# Altium schematic sheet 08 VCC-Connetor.SchDoc: CM4 IO
size 420 x 297 mm; Page Create Date: March  8, 1995; Page Number: 8; Page Size: A3; Comment: radxa_1010; Page Count: 19; RevCode: V1.10; Doc: 08 VCC-Connetor; DsnPath: D:\WMS\黄工\[RC126]CM4_IO_V1.10\[RC126]_V1.10\CM4 IO_V1.10.DSN; SchematicName: CM4 IO V1.10; PageName: 08 VCC-Connetor; PageSize: A3; TopSchematic: True
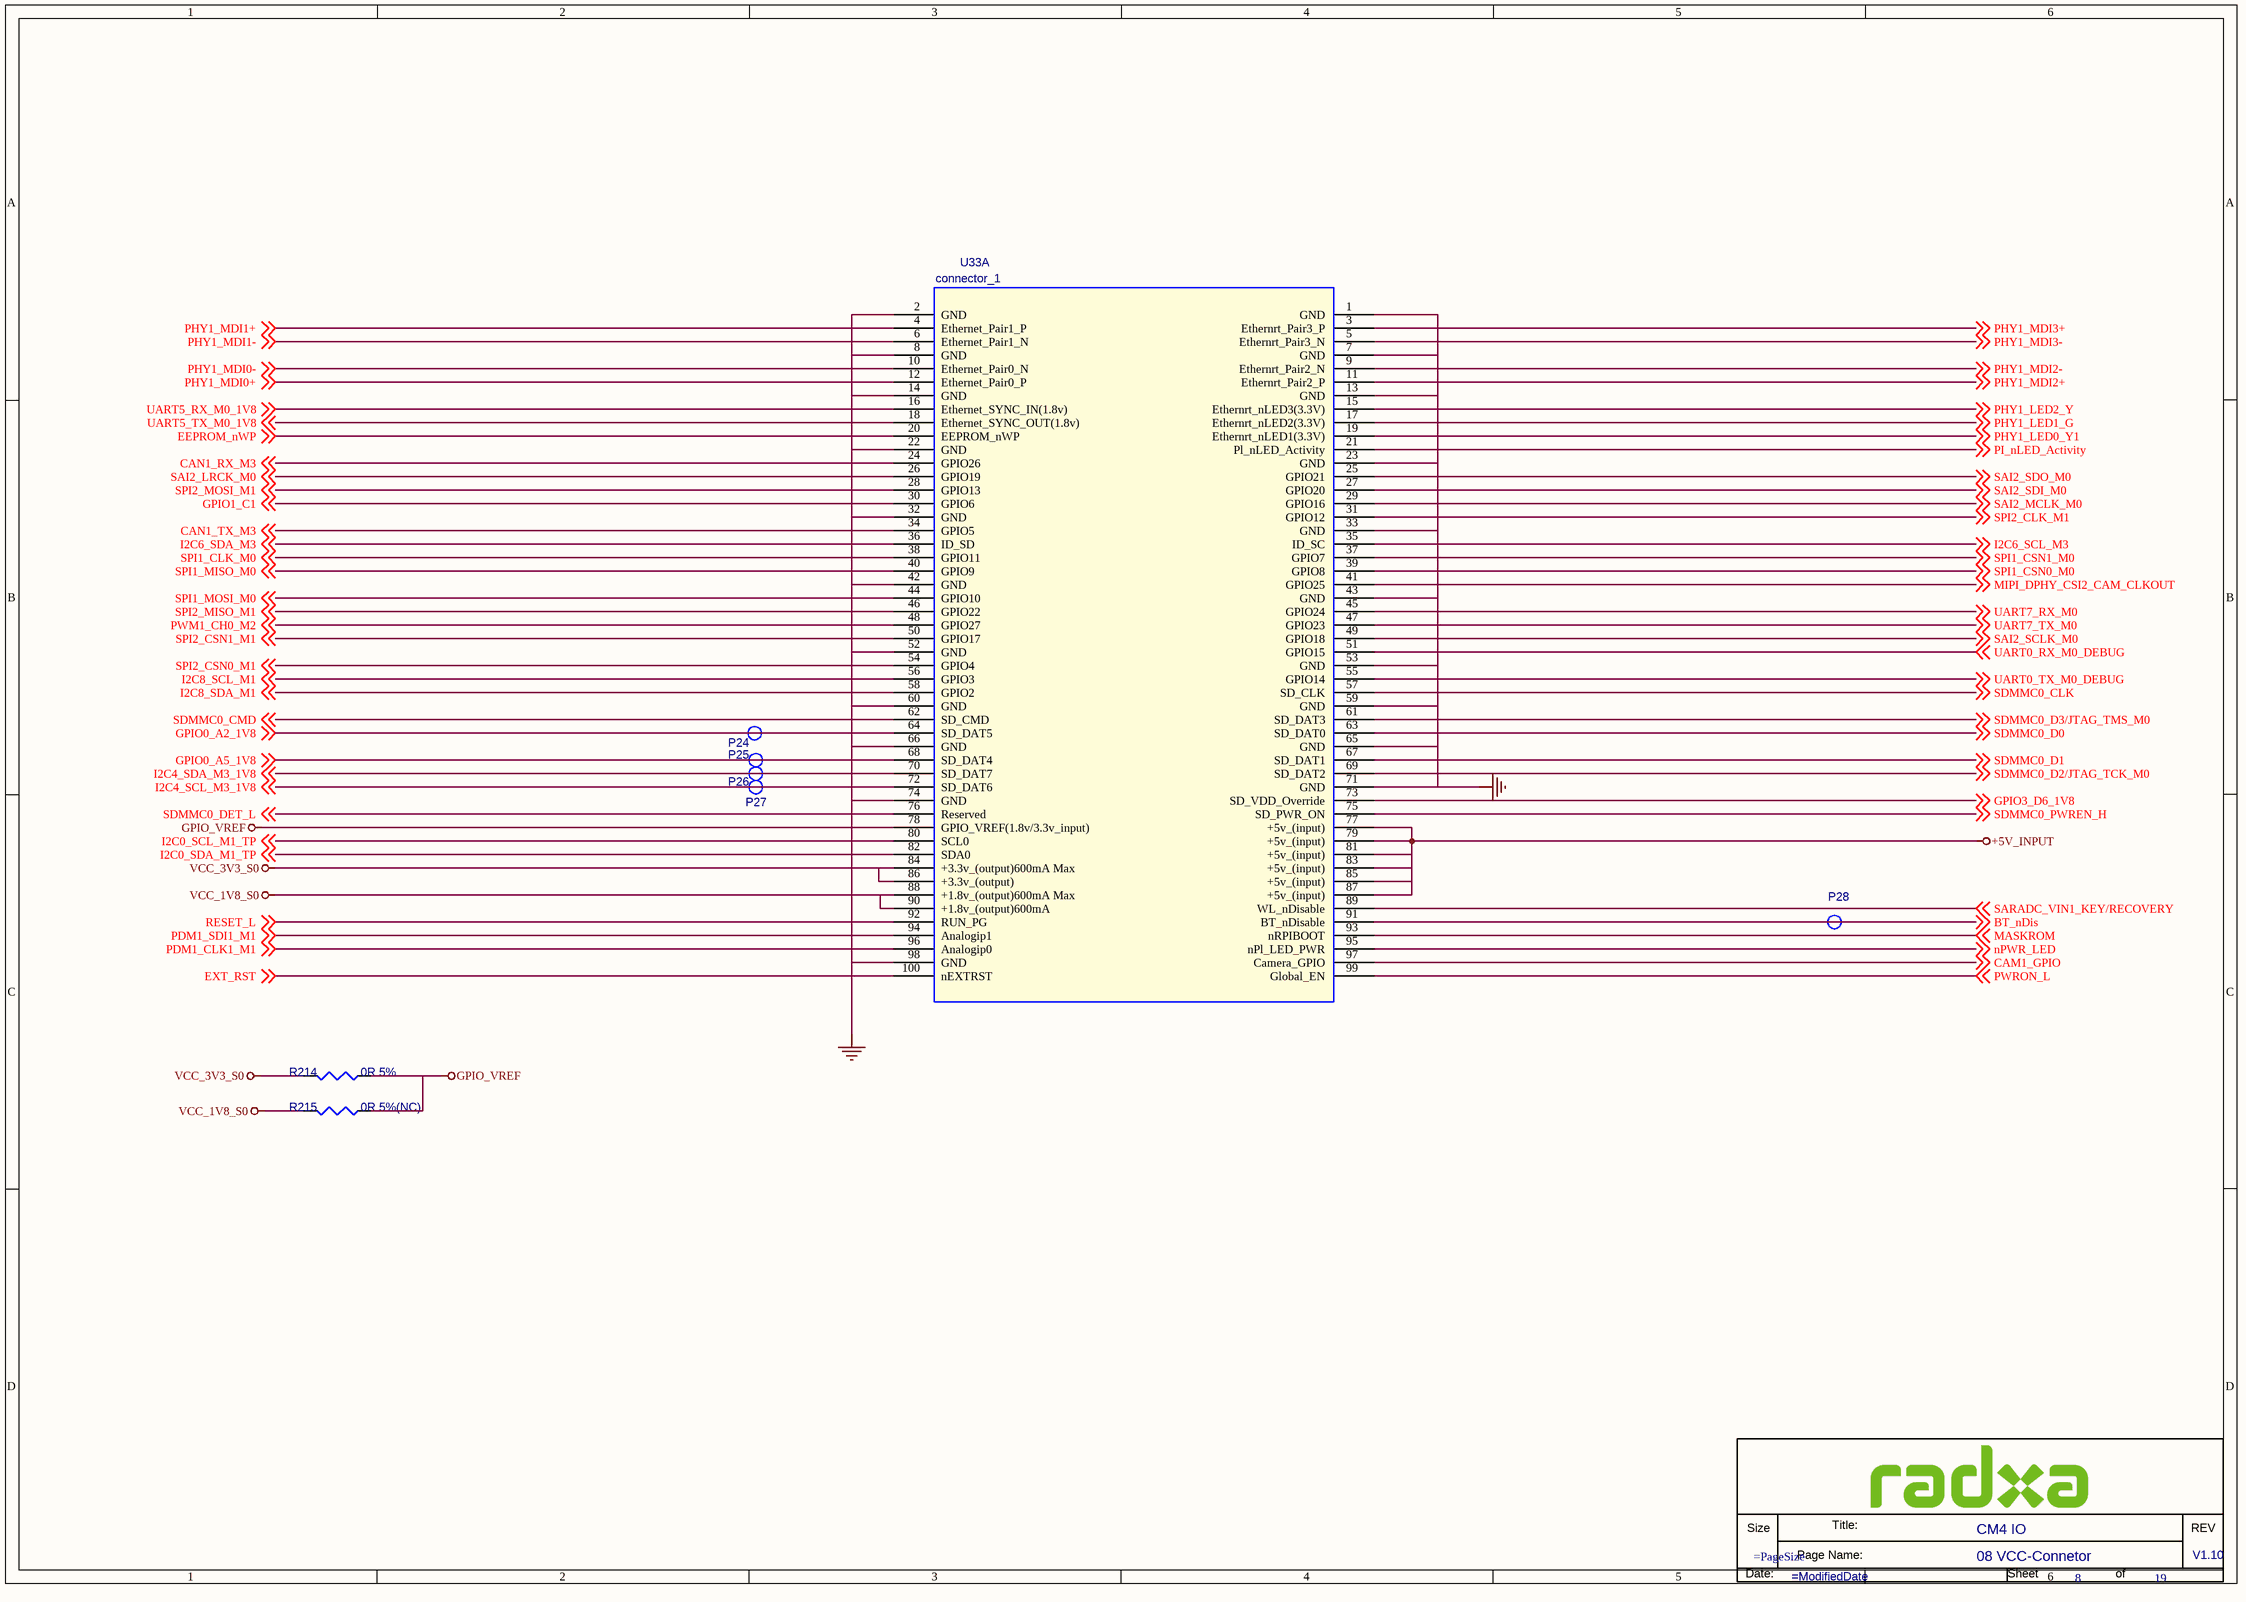
[diagram p0: 08 VCC-Connetor.SchDoc]

## Parts
*  Doc: 08 VCC-Connetor  RevCode: V1.10  Title: CM4 IO  Page Number: 8  Page Count: 19  (hidden comment: radxa_1010)  (graphical)
P24  TEST  [TEST]  (value not drawn)
P25  TEST  [TEST]  (value not drawn)
P26  TEST  [TEST]  (value not drawn)
P27  TEST  [TEST]  (value not drawn)
P28  TEST  [TEST]  (value not drawn)
R214  0R 5%  [R0402]
R215  0R 5%(NC)  [R0402]
U33  connector_1  [BTB_SMD100X2_0D4_STA]  (part A of 2)

## Nets
+5V_INPUT: U33.77(+5v_(input)) U33.79(+5v_(input)) U33.81(+5v_(input)) U33.83(+5v_(input)) U33.85(+5v_(input)) U33.87(+5v_(input))
GND: U33.1(GND) U33.2(GND) U33.7(GND) U33.8(GND) U33.13(GND) U33.14(GND) U33.22(GND) U33.23(GND) U33.32(GND) U33.33(GND) U33.42(GND) U33.43(GND) U33.52(GND) U33.53(GND) U33.59(GND) U33.60(GND) U33.65(GND) U33.66(GND) U33.71(GND) U33.74(GND) U33.98(GND)
GPIO_VREF: R214.1 R215.1 U33.78(GPIO_VREF(1.8v/3.3v_input))
VCC_1V8_S0: R215.2 U33.88(+1.8v_(output)600mA_Max) U33.90(+1.8v_(output)600mA)
VCC_3V3_S0: R214.2 U33.84(+3.3v_(output)600mA_Max) U33.86(+3.3v_(output))
BT_nDis: P28.1 U33.91(BT_nDisable) ; off-sheet BT_nDis
CAM1_GPIO: U33.97(Camera_GPIO) ; off-sheet CAM1_GPIO
CAN1_RX_M3: U33.24(GPIO26) ; off-sheet CAN1_RX_M3
CAN1_TX_M3: U33.34(GPIO5) ; off-sheet CAN1_TX_M3
EEPROM_nWP: U33.20(EEPROM_nWP) ; off-sheet EEPROM_nWP
EXT_RST: U33.100(nEXTRST) ; off-sheet EXT_RST
GPIO0_A2_1V8: P24.1 U33.64(SD_DAT5) ; off-sheet GPIO0_A2_1V8
GPIO0_A5_1V8: P25.1 U33.68(SD_DAT4) ; off-sheet GPIO0_A5_1V8
GPIO1_C1: U33.30(GPIO6) ; off-sheet GPIO1_C1
GPIO3_D6_1V8: U33.73(SD_VDD_Override) ; off-sheet GPIO3_D6_1V8
I2C0_SCL_M1_TP: U33.80(SCL0) ; off-sheet I2C0_SCL_M1_TP
I2C0_SDA_M1_TP: U33.82(SDA0) ; off-sheet I2C0_SDA_M1_TP
I2C4_SCL_M3_1V8: P27.1 U33.72(SD_DAT6) ; off-sheet I2C4_SCL_M3_1V8
I2C4_SDA_M3_1V8: P26.1 U33.70(SD_DAT7) ; off-sheet I2C4_SDA_M3_1V8
I2C6_SCL_M3: U33.35(ID_SC) ; off-sheet I2C6_SCL_M3
I2C6_SDA_M3: U33.36(ID_SD) ; off-sheet I2C6_SDA_M3
I2C8_SCL_M1: U33.56(GPIO3) ; off-sheet I2C8_SCL_M1
I2C8_SDA_M1: U33.58(GPIO2) ; off-sheet I2C8_SDA_M1
MASKROM: U33.93(nRPIBOOT) ; off-sheet MASKROM
MIPI_DPHY_CSI2_CAM_CLKOUT: U33.41(GPIO25) ; off-sheet MIPI_DPHY_CSI2_CAM_CLKOUT
nPWR_LED: U33.95(nPl_LED_PWR) ; off-sheet nPWR_LED
PDM1_CLK1_M1: U33.96(Analogip0) ; off-sheet PDM1_CLK1_M1
PDM1_SDI1_M1: U33.94(Analogip1) ; off-sheet PDM1_SDI1_M1
PHY1_LED0_Y1: U33.19(Ethernrt_nLED1(3.3V)) ; off-sheet PHY1_LED0_Y1
PHY1_LED1_G: U33.17(Ethernrt_nLED2(3.3V)) ; off-sheet PHY1_LED1_G
PHY1_LED2_Y: U33.15(Ethernrt_nLED3(3.3V)) ; off-sheet PHY1_LED2_Y
PHY1_MDI0+: U33.12(Ethernet_Pair0_P) ; off-sheet PHY1_MDI0+
PHY1_MDI0-: U33.10(Ethernet_Pair0_N) ; off-sheet PHY1_MDI0-
PHY1_MDI1+: U33.4(Ethernet_Pair1_P) ; off-sheet PHY1_MDI1+
PHY1_MDI1-: U33.6(Ethernet_Pair1_N) ; off-sheet PHY1_MDI1-
PHY1_MDI2+: U33.11(Ethernrt_Pair2_P) ; off-sheet PHY1_MDI2+
PHY1_MDI2-: U33.9(Ethernrt_Pair2_N) ; off-sheet PHY1_MDI2-
PHY1_MDI3+: U33.3(Ethernrt_Pair3_P) ; off-sheet PHY1_MDI3+
PHY1_MDI3-: U33.5(Ethernrt_Pair3_N) ; off-sheet PHY1_MDI3-
PI_nLED_Activity: U33.21(Pl_nLED_Activity) ; off-sheet PI_nLED_Activity
PWM1_CH0_M2: U33.48(GPIO27) ; off-sheet PWM1_CH0_M2
PWRON_L: U33.99(Global_EN) ; off-sheet PWRON_L
RESET_L: U33.92(RUN_PG) ; off-sheet RESET_L
SAI2_LRCK_M0: U33.26(GPIO19) ; off-sheet SAI2_LRCK_M0
SAI2_MCLK_M0: U33.29(GPIO16) ; off-sheet SAI2_MCLK_M0
SAI2_SCLK_M0: U33.49(GPIO18) ; off-sheet SAI2_SCLK_M0
SAI2_SDI_M0: U33.27(GPIO20) ; off-sheet SAI2_SDI_M0
SAI2_SDO_M0: U33.25(GPIO21) ; off-sheet SAI2_SDO_M0
SARADC_VIN1_KEY/RECOVERY: U33.89(WL_nDisable) ; off-sheet SARADC_VIN1_KEY/RECOVERY
SDMMC0_CLK: U33.57(SD_CLK) ; off-sheet SDMMC0_CLK
SDMMC0_CMD: U33.62(SD_CMD) ; off-sheet SDMMC0_CMD
SDMMC0_D0: U33.63(SD_DAT0) ; off-sheet SDMMC0_D0
SDMMC0_D1: U33.67(SD_DAT1) ; off-sheet SDMMC0_D1
SDMMC0_D2/JTAG_TCK_M0: U33.69(SD_DAT2) ; off-sheet SDMMC0_D2/JTAG_TCK_M0
SDMMC0_D3/JTAG_TMS_M0: U33.61(SD_DAT3) ; off-sheet SDMMC0_D3/JTAG_TMS_M0
SDMMC0_DET_L: U33.76(Reserved) ; off-sheet SDMMC0_DET_L
SDMMC0_PWREN_H: U33.75(SD_PWR_ON) ; off-sheet SDMMC0_PWREN_H
SPI1_CLK_M0: U33.38(GPIO11) ; off-sheet SPI1_CLK_M0
SPI1_CSN0_M0: U33.39(GPIO8) ; off-sheet SPI1_CSN0_M0
SPI1_CSN1_M0: U33.37(GPIO7) ; off-sheet SPI1_CSN1_M0
SPI1_MISO_M0: U33.40(GPIO9) ; off-sheet SPI1_MISO_M0
SPI1_MOSI_M0: U33.44(GPIO10) ; off-sheet SPI1_MOSI_M0
SPI2_CLK_M1: U33.31(GPIO12) ; off-sheet SPI2_CLK_M1
SPI2_CSN0_M1: U33.54(GPIO4) ; off-sheet SPI2_CSN0_M1
SPI2_CSN1_M1: U33.50(GPIO17) ; off-sheet SPI2_CSN1_M1
SPI2_MISO_M1: U33.46(GPIO22) ; off-sheet SPI2_MISO_M1
SPI2_MOSI_M1: U33.28(GPIO13) ; off-sheet SPI2_MOSI_M1
UART0_RX_M0_DEBUG: U33.51(GPIO15) ; off-sheet UART0_RX_M0_DEBUG
UART0_TX_M0_DEBUG: U33.55(GPIO14) ; off-sheet UART0_TX_M0_DEBUG
UART5_RX_M0_1V8: U33.16(Ethernet_SYNC_IN(1.8v)) ; off-sheet UART5_RX_M0_1V8
UART5_TX_M0_1V8: U33.18(Ethernet_SYNC_OUT(1.8v)) ; off-sheet UART5_TX_M0_1V8
UART7_RX_M0: U33.45(GPIO24) ; off-sheet UART7_RX_M0
UART7_TX_M0: U33.47(GPIO23) ; off-sheet UART7_TX_M0

## Notes on the sheet
- (in symbol radxa_1010) Size; Title:; REV; Page Name:; Date:; Sheet; of

## Library data of the parts
P24 = TESTPOINT1: Part Reference: P24; PCB Footprint: TP_0R70; Value: TEST
P25 = TESTPOINT1: Part Reference: P25; PCB Footprint: TP_0R70; Value: TEST
P26 = TESTPOINT1: Part Reference: P26; PCB Footprint: TP_0R70; Value: TEST
P27 = TESTPOINT1: Part Reference: P27; PCB Footprint: TP_0R70; Value: TEST
P28 = TESTPOINT1: Part Reference: P28; PCB Footprint: TP_0R70; Value: TEST
R214 = R: SMD  0201  0R  1/20W  ±5%  ROHS; Part Reference: R214; Part Number: A1R01.00027; PCB Footprint: R0201; Preferred: 6715f349cd0bc5; Temp Coeff: -55℃ to +125℃; Value: 0R 5%; Part Type: 贴片电阻
R215 = R: SMD  0201  0R  1/20W  ±5%  ROHS; Part Reference: R215; Part Number: A1R01.00027; PCB Footprint: R0201; Temp Coeff: -55℃ to +125℃; Preferred: 6715f349cd0bc5; Value: 0R 5%(NC); Part Type: 贴片电阻
U33 = HETER_4: Part Reference: U33; Value: connector_1; PCB Footprint: BTB_SMD100X2_0D4_STA
* = radxa_1010: Page Create Date: March  8, 1995; Page Size: =PageSize; Page Modify Date: =ModifiedDate